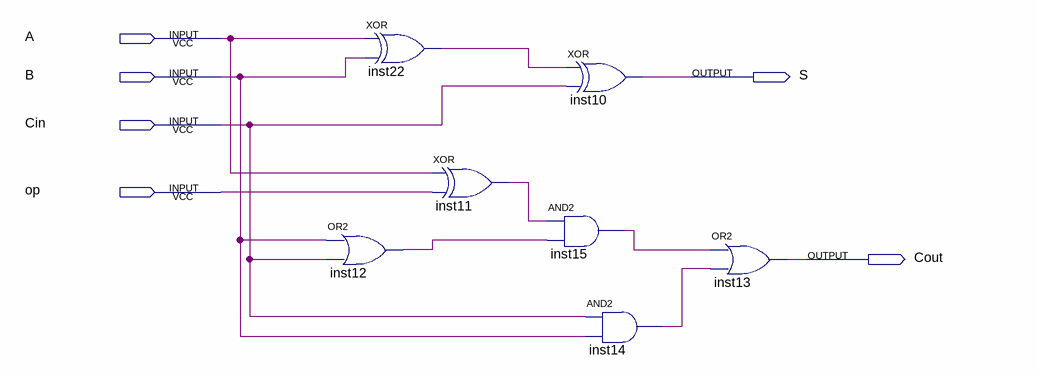
[diagram p0: schematic sheet]
// Quartus schematic caixinha.bdf as structural Verilog: 7 symbols, 6 pins
module caixinha (
  input  A,
  input  B,
  input  Cin,
  input  op,
  output S,
  output Cout
);

  wire inst11_out, inst12_out, inst14_out, inst15_out, inst22_out;

  xor inst22 (inst22_out, A, B);
  or inst12 (inst12_out, B, Cin);
  xor inst11 (inst11_out, A, op);
  and inst15 (inst15_out, inst11_out, inst12_out);
  xor inst10 (S, inst22_out, Cin);
  and inst14 (inst14_out, Cin, B);
  or inst13 (Cout, inst15_out, inst14_out);
endmodule
